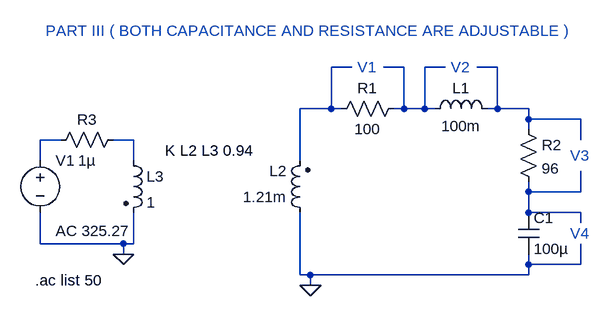
[diagram p0: schematic EXP1_PART1_CIRCUITO3.asc]
EXP1_PART1_CIRCUITO3.asc, the LTspice schematic file:
Version 4
SHEET 1 880 680
WIRE 160 32 128 32
WIRE 240 32 208 32
WIRE 304 32 272 32
WIRE 384 32 352 32
WIRE 128 96 128 32
WIRE 128 96 80 96
WIRE 144 96 128 96
WIRE 240 96 240 32
WIRE 240 96 224 96
WIRE 272 96 272 32
WIRE 272 96 240 96
WIRE 288 96 272 96
WIRE 384 96 384 32
WIRE 384 96 368 96
WIRE 432 96 384 96
WIRE 432 112 432 96
WIRE 512 112 432 112
WIRE 432 128 432 112
WIRE -288 144 -320 144
WIRE -176 144 -208 144
WIRE 512 144 512 112
WIRE -320 176 -320 144
WIRE -176 176 -176 144
WIRE 80 176 80 96
WIRE 432 224 432 208
WIRE 512 224 512 192
WIRE 512 224 432 224
WIRE 432 256 432 224
WIRE 512 256 432 256
WIRE 512 272 512 256
WIRE -320 304 -320 256
WIRE -192 304 -320 304
WIRE -176 304 -176 256
WIRE -176 304 -192 304
WIRE -192 320 -192 304
WIRE 432 336 432 320
WIRE 512 336 512 304
WIRE 512 336 432 336
WIRE 80 352 80 256
WIRE 96 352 80 352
WIRE 432 352 432 336
WIRE 432 352 96 352
WIRE 96 368 96 352
FLAG -192 320 0
FLAG 96 368 0
SYMBOL res 240 80 R90
WINDOW 0 0 56 VBottom 2
WINDOW 3 32 56 VTop 2
SYMATTR InstName R1
SYMATTR Value 100
SYMBOL ind 272 112 R270
WINDOW 0 32 56 VTop 2
WINDOW 3 5 56 VBottom 2
SYMATTR InstName L1
SYMATTR Value 100m
SYMBOL res 416 112 R0
SYMATTR InstName R2
SYMATTR Value 96
SYMBOL cap 416 256 R0
SYMATTR InstName C1
SYMATTR Value 100µ
SYMBOL ind2 96 272 R180
WINDOW 0 36 80 Left 2
WINDOW 3 36 40 Left 2
SYMATTR InstName L2
SYMATTR Value 1.21m
SYMATTR Type ind
SYMBOL ind2 -192 160 R0
SYMATTR InstName L3
SYMATTR Value 1
SYMATTR Type ind
SYMBOL voltage -320 160 R0
WINDOW 123 24 124 Left 2
WINDOW 39 0 0 Left 0
SYMATTR InstName V1
SYMATTR Value ""
SYMATTR Value2 AC 325.27
SYMBOL res -192 128 R90
WINDOW 0 0 56 VBottom 2
WINDOW 3 32 56 VTop 2
SYMATTR InstName R3
SYMATTR Value 1µ
TEXT -128 160 Left 2 !K L2 L3 0.94
TEXT 168 32 Left 2 ;V1
TEXT 312 32 Left 2 ;V2
TEXT 496 168 Left 2 ;V3
TEXT 496 288 Left 2 ;V4
TEXT -312 -24 Left 2 ;PART III ( BOTH CAPACITANCE AND RESISTANCE ARE ADJUSTABLE )
TEXT -328 360 Left 2 !.ac list 50

The netlist it stands for:
* EXP1_PART1_CIRCUITO3.asc
R1 N002 N001 100
L1 N002 N003 100m
R2 N003 N006 96
C1 N006 0 100µ
L2 0 N001 1.21m
L3 N005 0 1
V1 N004 0 AC 325.27
R3 N005 N004 1µ
K L2 L3 0.94
* V1
* V2
* V3
* V4
* PART III ( BOTH CAPACITANCE AND RESISTANCE ARE ADJUSTABLE )
.ac list 50
.backanno
.end